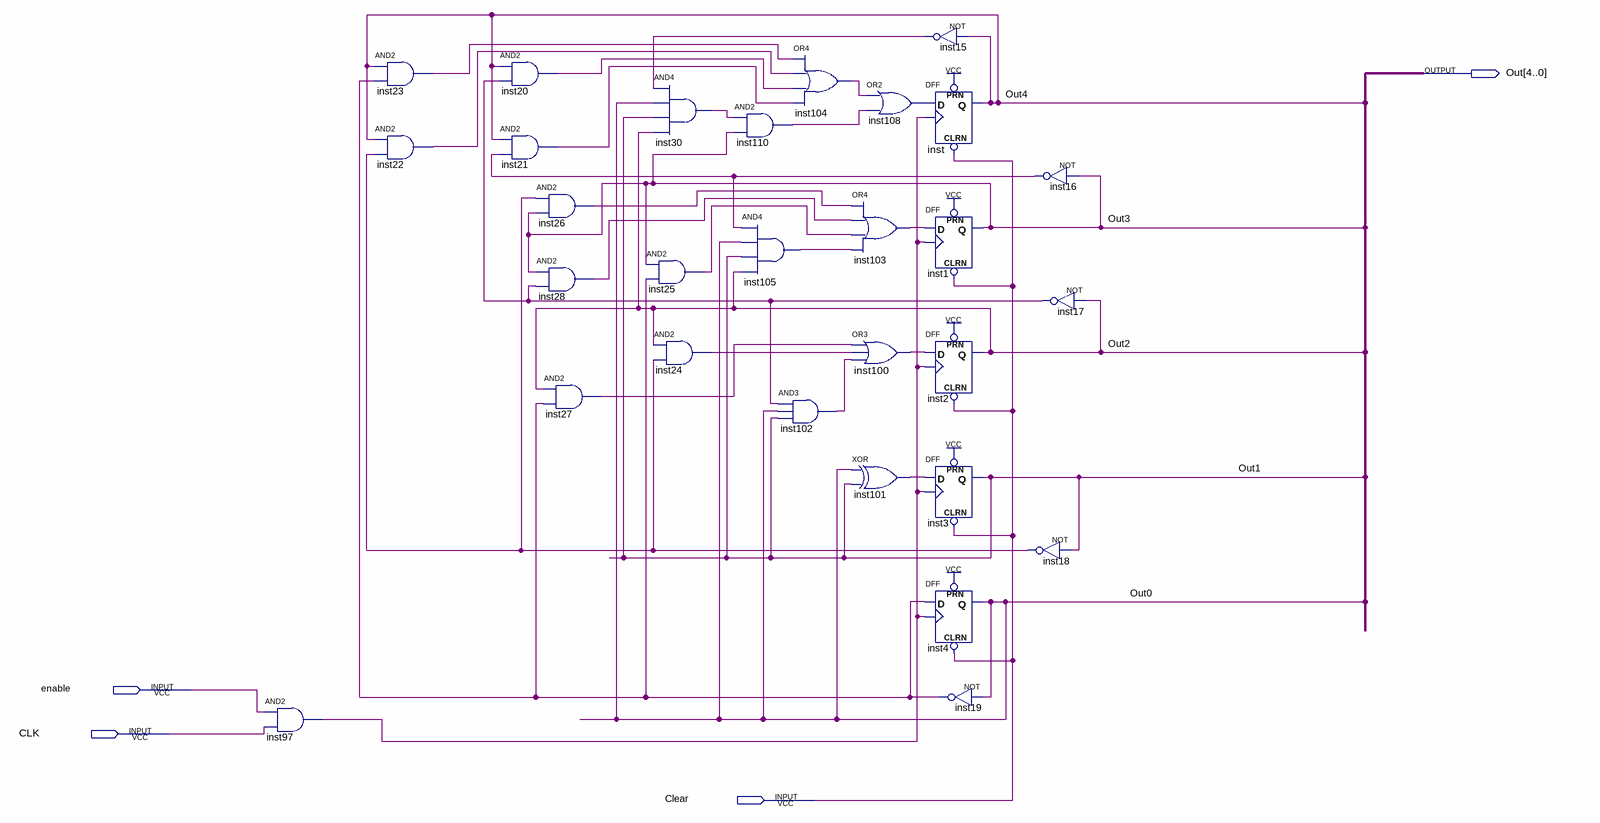
[diagram p0: schematic sheet]
// Quartus schematic mod32main.bdf as structural Verilog: 29 symbols, 4 pins
module mod32main (
  input  enable,
  input  CLK,
  input  Clear,
  output [4:0] Out
);

  wire inst15_out, inst16_out, inst17_out, inst18_out, inst19_out, inst20_out, inst21_out, inst22_out,
       inst23_out, inst24_out, inst25_out, inst26_out, inst27_out, inst28_out, inst30_out, inst97_out,
       inst100_out, inst101_out, inst102_out, inst103_out, inst104_out, inst105_out, inst108_out, inst110_out;

  and inst97 (inst97_out, enable, CLK);
  and inst23 (inst23_out, Out[4], inst19_out);
  and inst22 (inst22_out, Out[4], inst18_out);
  and inst20 (inst20_out, Out[4], inst17_out);
  and inst21 (inst21_out, Out[4], inst16_out);
  and inst26 (inst26_out, inst18_out, Out[3]);
  and inst28 (inst28_out, Out[3], inst17_out);
  and inst27 (inst27_out, Out[2], inst19_out);
  and inst30 (inst30_out, inst15_out, Out[0], Out[1], Out[2]);
  and inst25 (inst25_out, Out[3], inst19_out);
  and inst24 (inst24_out, Out[2], inst18_out);
  and inst110 (inst110_out, inst30_out, Out[3]);
  and inst105 (inst105_out, inst16_out, Out[0], Out[1], Out[2]);
  or inst104 (inst104_out, inst23_out, inst22_out, inst20_out, inst21_out);
  and inst102 (inst102_out, inst17_out, Out[0], Out[1]);
  or inst108 (inst108_out, inst104_out, inst110_out);
  or inst103 (inst103_out, inst26_out, inst28_out, inst25_out, inst105_out);
  or inst100 (inst100_out, inst27_out, inst24_out, inst102_out);
  xor inst101 (inst101_out, Out[0], Out[1]);
  not inst15 (inst15_out, Out[4]);
  DFF inst (.CLRN(Clear), .CLK(inst97_out), .D(inst108_out), .PRN(1'b1), .Q(Out[4]));
  DFF inst1 (.CLRN(Clear), .CLK(inst97_out), .D(inst103_out), .PRN(1'b1), .Q(Out[3]));
  DFF inst2 (.CLRN(Clear), .CLK(inst97_out), .D(inst100_out), .PRN(1'b1), .Q(Out[2]));
  DFF inst3 (.CLRN(Clear), .CLK(inst97_out), .D(inst101_out), .PRN(1'b1), .Q(Out[1]));
  DFF inst4 (.CLRN(Clear), .CLK(inst97_out), .D(inst19_out), .PRN(1'b1), .Q(Out[0]));
  not inst19 (inst19_out, Out[0]);
  not inst16 (inst16_out, Out[3]);
  not inst17 (inst17_out, Out[2]);
  not inst18 (inst18_out, Out[1]);
endmodule
